# Altium schematic sheet mcu_power.SchDoc: Fault-Tolerant Quadcopter
size A; DrawnBy: Vaughn Kottler; Engineer: Vaughn Kottler; Revision: A
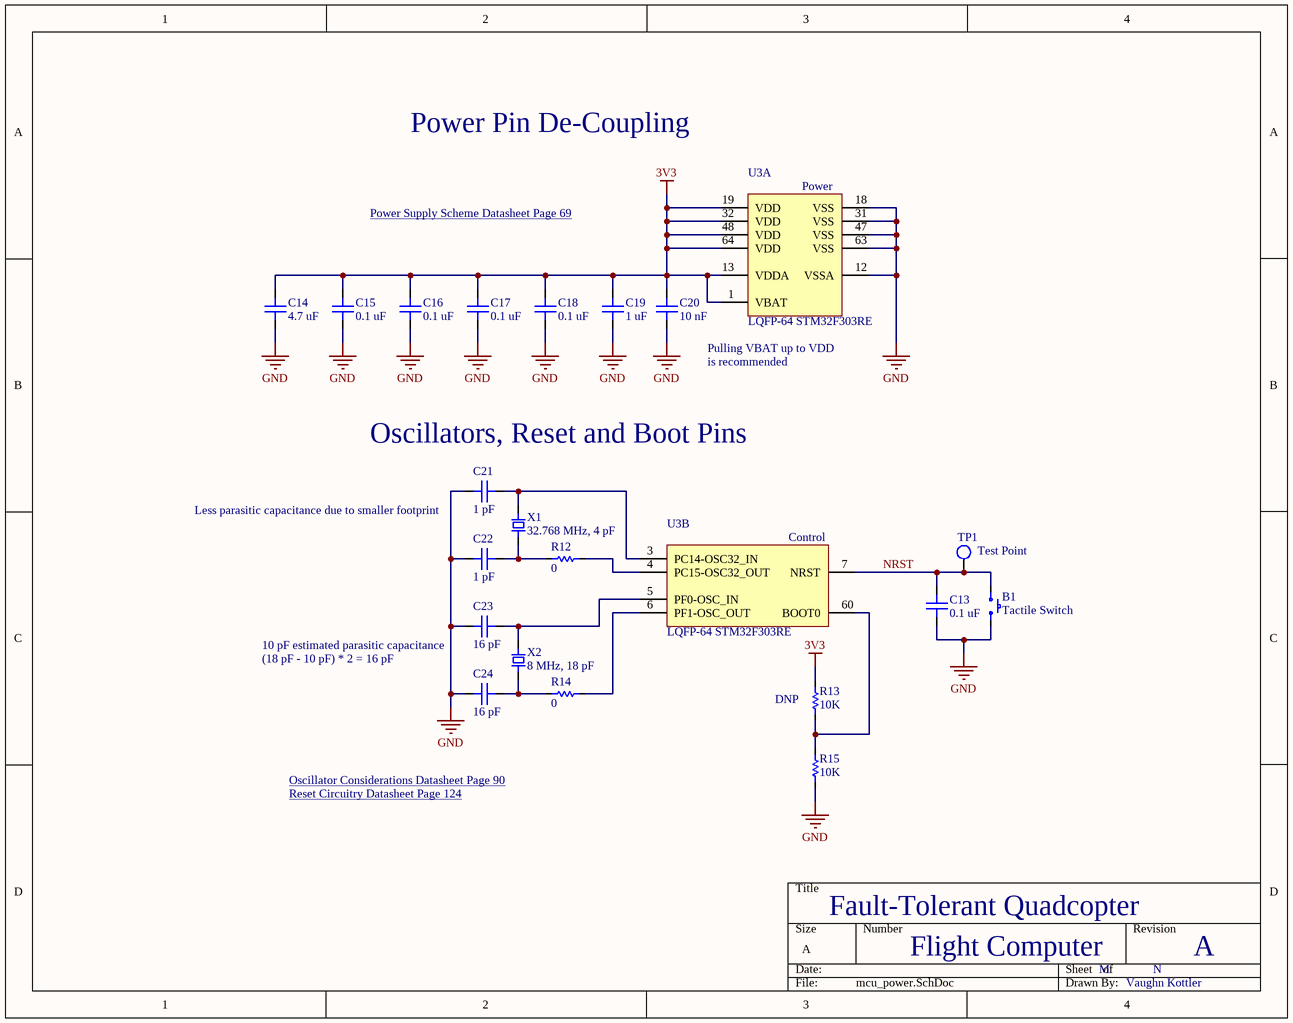
[diagram p0: mcu_power.SchDoc]

## Parts
B1  Tactile Switch  [6mm Tactile Switch]
C13  0.1 uF  [CAP-CER-0805-SHORT]
C14  4.7 uF  [CAP-CER-0805-TALL]
C15  0.1 uF  [CAP-CER-0805-SHORT]
C16  0.1 uF  [CAP-CER-0805-SHORT]
C17  0.1 uF  [CAP-CER-0805-SHORT]
C18  0.1 uF  [CAP-CER-0805-SHORT]
C19  1 uF  [CAP-CER-0805-TALL]
C20  10 nF  [CAP-CER-0805-SHORT]
C21  1 pF  [CAP-CER-0805-SHORT]
C22  1 pF  [CAP-CER-0805-SHORT]
C23  16 pF  [CAP-CER-0805-SHORT]
C24  16 pF  [CAP-CER-0805-SHORT]
R12  0  [RES-0805]
R13  10K  [RES-0805]
R14  0  [RES-0805]
R15  10K  [RES-0805]
TP1  Test Point  [0603 Test Point]
U3  LQFP-64 STM32F303RE  [LQFP64]  (parts A,B of 6)
X1  32.768 MHz, 4 pF  [XTAL-0805]
X2  8 MHz, 18 pF  [HC-49]

## Nets
3V3: C14.2 C15.2 C16.2 C17.2 C18.2 C19.2 C20.2 R13.2 U3.1(VBAT) U3.13(VDDA) U3.19(VDD) U3.32(VDD) U3.48(VDD) U3.64(VDD)
GND: B1.2 C13.1 C14.1 C15.1 C16.1 C17.1 C18.1 C19.1 C20.1 C21.1 C22.1 C23.1 C24.1 R15.1 U3.12(VSSA) U3.18(VSS) U3.31(VSS) U3.47(VSS) U3.63(VSS)
NRST: B1.1 C13.2 TP1.1 U3.7(NRST)
NetC21_2: C21.2 U3.3(PC14-OSC32_IN) X1.2
NetC22_2: C22.2 R12.1 X1.1
NetC23_2: C23.2 U3.5(PF0-OSC_IN) X2.2
NetC24_2: C24.2 R14.1 X2.1
NetR12_2: R12.2 U3.4(PC15-OSC32_OUT)
NetR13_1: R13.1 R15.2 U3.60(BOOT0)
NetR14_2: R14.2 U3.6(PF1-OSC_OUT)

## Notes on the sheet
- Power Pin De-Coupling
- Power Supply Scheme Datasheet Page 69 <https://www.st.com/content/ccc/resource/technical/document/datasheet/2c/6f/d7/64/1f/a3/4f/c9/DM00118585.pdf/files/DM00118585.pdf/jcr:content/translations/en.DM00118585.pdf>
- Pulling VBAT up to VDD
- is recommended
- Oscillators, Reset and Boot Pins
- Less parasitic capacitance due to smaller footprint
- (near C23) 10 pF estimated parasitic capacitance
- (18 pF - 10 pF) * 2 = 16 pF
- (near R13) DNP
- Oscillator Considerations Datasheet Page 90 <https://www.st.com/content/ccc/resource/technical/document/datasheet/2c/6f/d7/64/1f/a3/4f/c9/DM00118585.pdf/files/DM00118585.pdf/jcr:content/translations/en.DM00118585.pdf>
- Reset Circuitry Datasheet Page 124 <https://www.st.com/content/ccc/resource/technical/document/datasheet/2c/6f/d7/64/1f/a3/4f/c9/DM00118585.pdf/files/DM00118585.pdf/jcr:content/translations/en.DM00118585.pdf>
- Flight Computer
- M
- N
- (in symbol STM32F303RET6, part A) Power
- (in symbol STM32F303RET6, part B) Control

## Library data of the parts
B1 = Tactile Switch: NO, MOM, 6mm; Supplier 1: Digi-Key; Supplier Part Number 1: CKN9112DKR-ND
C13 C15-C18 = CAP-CER-0.1uF-25V: 10%, 0805; ComponentLink1Description: Capacitor Book (Amazon); ComponentLink1URL: https://www.amazon.com/gp/product/B0728HBDRW/
C14 = CAP-CER-4.7uF-10V: 10%, 0805; ComponentLink1Description: Capacitor Book (Amazon); ComponentLink1URL: https://www.amazon.com/gp/product/B0728HBDRW/
C19 = CAP-CER-1uF-10V: 10%, 0805; ComponentLink1Description: Capacitor Book (Amazon); ComponentLink1URL: https://www.amazon.com/gp/product/B0728HBDRW/
C20 = CAP-CER-10nF-50V: 10%, 0805; ComponentLink1Description: Capacitor Book (Amazon); ComponentLink1URL: https://www.amazon.com/gp/product/B0728HBDRW/
C21 C22 = CAP-CER-1pF-50V: ±0.25pF, 0805; ComponentLink1Description: Capacitor Book (Amazon); ComponentLink1URL: https://www.amazon.com/gp/product/B0728HBDRW/
C23 C24 = CAP-CER-16pF-50V: ±5%, 0805; ComponentLink1Description: Capacitor Book (Amazon); ComponentLink1URL: https://www.amazon.com/gp/product/B0728HBDRW/
R12 R14 = RES-0-1/8W: 0805; ComponentLink1Description: Resistor Book (Amazon); ComponentLink1URL: https://www.amazon.com/gp/product/B071J21FYF/
R13 R15 = RES-10K-1/8W: 0805; ComponentLink1Description: Resistor Book (Amazon); ComponentLink1URL: https://www.amazon.com/gp/product/B071J21FYF/
TP1 = Test Point: 0603; Supplier 1: Digi-Key; Supplier Part Number 1: A106145DKR-ND
U3 = STM32F303RET6: ARM Cortex-M4 32-bit MCU+FPU; Supplier 1: Digi-Key; ComponentLink1Description: NUCLEO-F303RE; ComponentLink1URL: https://www.st.com/content/st_com/en/products/evaluation-tools/product-evaluation-tools/mcu-eval-tools/stm32-mcu-eval-tools/stm32-mcu-nucleo/nucleo-f303re.html; ComponentLink2Description: MBED; ComponentLink2URL: https://os.mbed.com/platforms/ST-Nucleo-F303RE/; ComponentLink3Description: Datasheet; ComponentLink3URL: https://www.st.com/content/ccc/resource/technical/document/datasheet/2c/6f/d7/64/1f/a3/4f/c9/DM00118585.pdf/files/DM00118585.pdf/jcr:content/translations/en.DM00118585.pdf; Supplier Part Number 1: 497-15163-ND
X1 = XTAL-32.768kHz-4pF: Crystal, 0805; Supplier 1: Digi-Key; ComponentLink1Description: Datasheet; ComponentLink1URL: https://abracon.com/Resonators/ABS06-107-32.768kHz-T.pdf; Supplier Part Number 1: 535-12373-6-ND
X2 = XTAL-8MHz-18pF: Crystal, HC-49; Supplier 1: Digi-Key; ComponentLink1Description: Datasheet; ComponentLink1URL: https://abracon.com/Resonators/abls.pdf; Supplier Part Number 1: 535-9089-6-ND